# EAGLE design attiny85 (EAGLE 9.6.2)
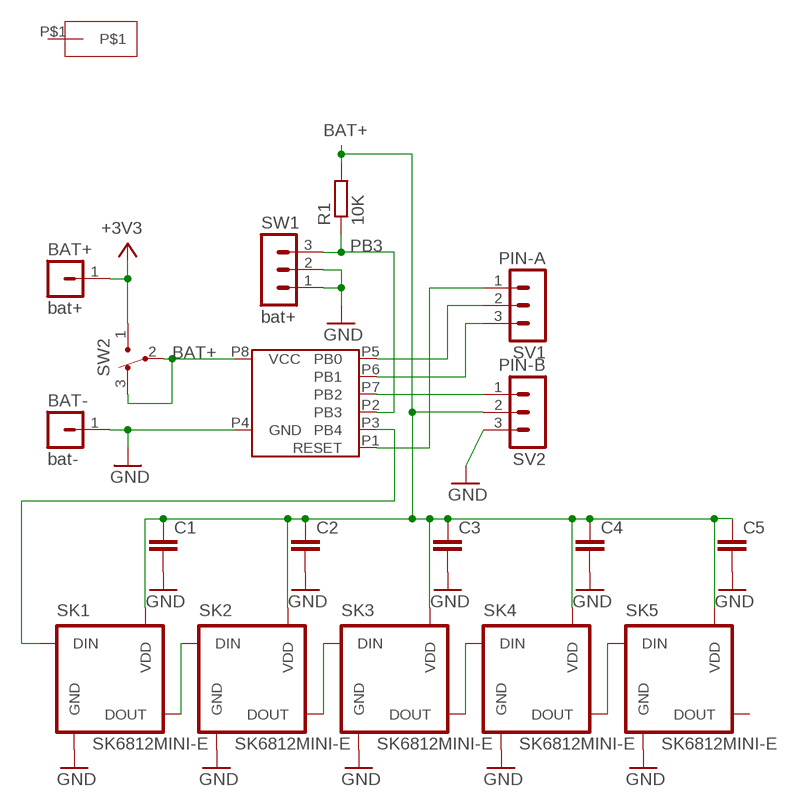
[diagram p0: schematic, sheet 1]

## Parts
ATTINY85-1  ATTINY85  ATTINY85SOP8  [ATTINY85-20SUR]
BAT+  bat+  PINHEAD-MA01-1  [PINHEAD-MA01-1]
BAT-  bat-  PINHEAD-MA01-1  [PINHEAD-MA01-1]
C1  C-EUC2012  [C2012]
C2  C-EUC2012  [C2012]
C3  C-EUC2012  [C2012]
C4  C-EUC2012  [C2012]
C5  C-EUC2012  [C2012]
PAD33  PAD150X50  [PAD5X15]
R1  10K  R-EU_M3216  [M3216]
SK1  SK6812MINI-E  [SK6812MINI-E]
SK2  SK6812MINI-E  [SK6812MINI-E]
SK3  SK6812MINI-E  [SK6812MINI-E]
SK4  SK6812MINI-E  [SK6812MINI-E]
SK5  SK6812MINI-E  [SK6812MINI-E]
SV1  PIN-A  PINHEAD-MA03-1  [PINHEAD-MA03-1]
SV2  PIN-B  PINHEAD-MA03-1  [PINHEAD-MA03-1]
SW1  bat+  PINHEAD-MA03-1  [PINHEAD-MA03-1]
SW2  POWER  SW3-1  [SW3-1]

## Nets
+3V3: BAT+.1 SW2.1
BAT+: ATTINY85-1.P8(VCC) C1.1 C2.1 C3.1 C4.1 C5.1 R1.2 SK1.VDD SK2.VDD SK3.VDD SK4.VDD SK5.VDD SV2.2 SW2.2 SW2.3
GND: ATTINY85-1.P4(GND) BAT-.1 C1.2 C2.2 C3.2 C4.2 C5.2 SK1.GND SK2.GND SK3.GND SK4.GND SK5.GND SV2.3 SW1.1 SW1.2
N$1: ATTINY85-1.P3(PB4) SK1.DIN
N$2: ATTINY85-1.P7(PB2) SV2.1
N$3: ATTINY85-1.P6(PB1) SV1.3
N$4: ATTINY85-1.P1(RESET) SV1.1
N$5: ATTINY85-1.P5(PB0) SV1.2
N$6: SK1.DOUT SK2.DIN
N$7: SK2.DOUT SK3.DIN
N$8: SK3.DOUT SK4.DIN
N$9: SK4.DOUT SK5.DIN
PB3: ATTINY85-1.P2(PB3) R1.1 SW1.3
Unconnected: PAD33.P$1 SK5.DOUT

## Library data of the parts
ATTINY85-1 = ytani1:ATTINY85
BAT+ BAT- = ytani1:PINHEAD-MA01-1
C1-C5 = rcl:C-EU: CAPACITOR, European symbol; SPICEPREFIX: C
PAD33 = ytani1:PAD
R1 = rcl:R-EU_: RESISTOR, European symbol; SPICEPREFIX: R
SK1-SK5 = ytani1:SK6812MINI-E
SV1 SV2 SW1 = ytani1:PINHEAD-MA03-1: PIN HEADER; OC_FARNELL: unknown; OC_NEWARK: unknown
SW2 = ytani1:SW3-1: Slide Switch 3x1 pin https://www.amazon.co.jp/gp/product/B01LYVYQNO/ SS12D00G3 2ポジションSPDT 1P2T 3ピン; MF: HiLetgo; URL_AMAZON: https://www.amazon.co.jp/gp/product/B01LYVYQNO/

## Board
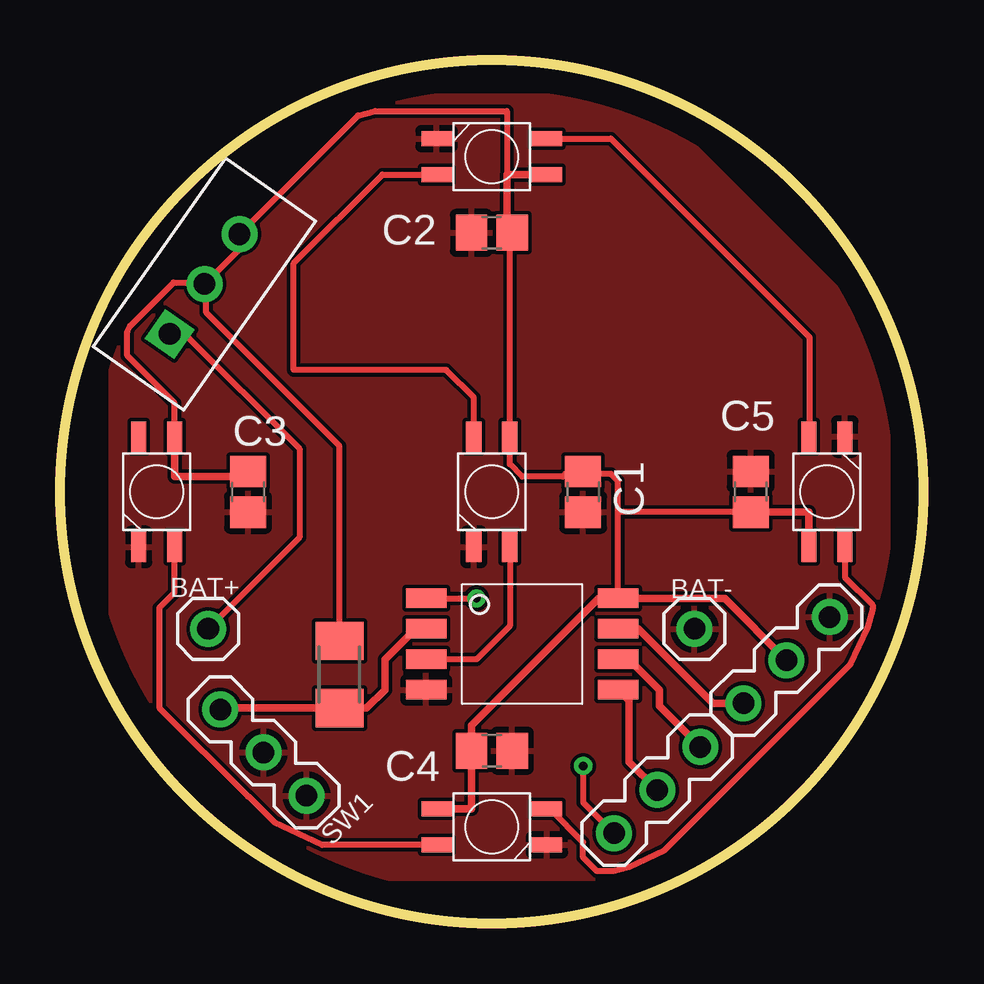
[diagram p1: board, top side]
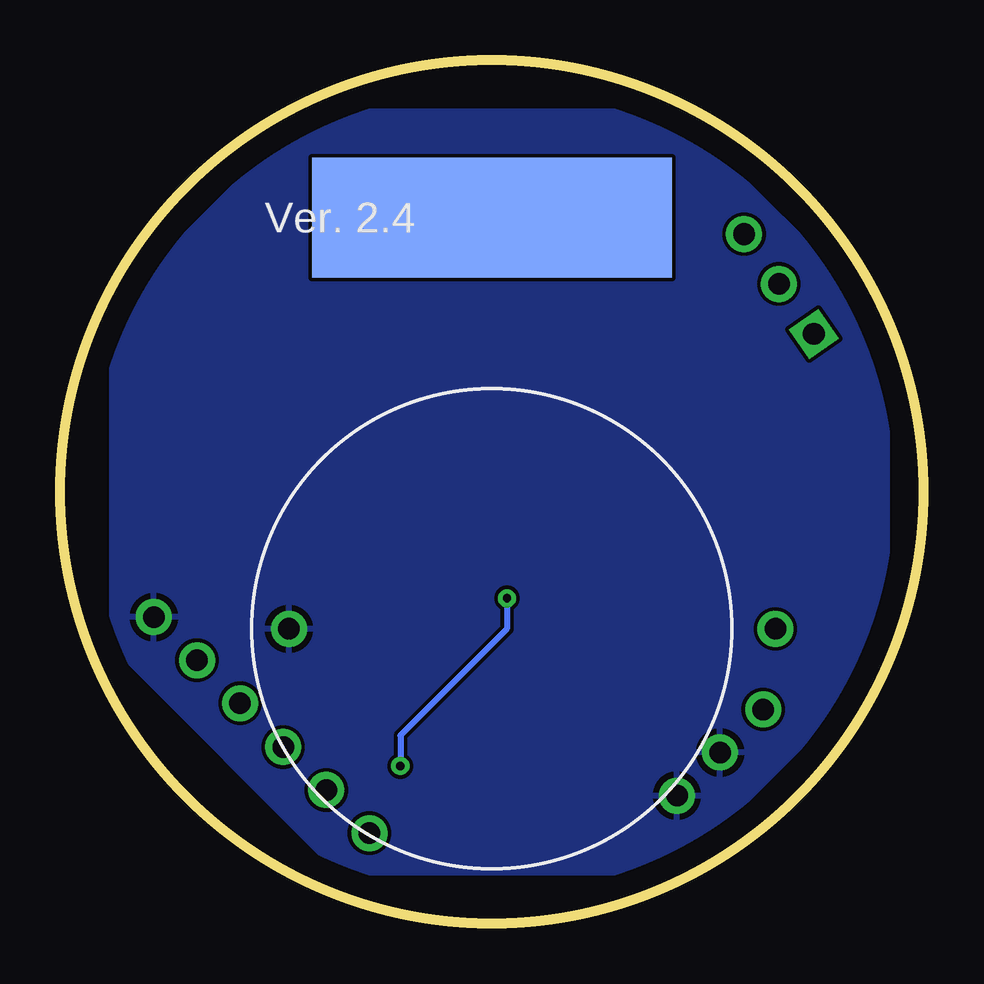
[diagram p2: board, bottom side, seen from below]

Size 36 x 36 mm. Coordinates in mm from the lower left corner, seen from the top.
Outline: circle at 18,18 radius 18
Copper layers (1*16): Top 0.035mm / dielectric 1.5mm / Bottom 0.035mm
Design rules "default": minimum track width 6mil, minimum drill 0.35mm, track to track 6mil, track to pad 6mil, pad to pad 6mil, via to via 6mil, smd to smd 6mil, copper to edge 40mil, drill to drill 6mil, minimum pad ring 10mil, minimum via ring 8mil, stop-mask expansion 4mil, vias tented up to drill 0mil, thermal gap 10mil

### Footprints (pad centres in the part's own frame; a part is rotated, then mirrored left to right if it is on the bottom)
ATTINY85-20SUR = smd 1.676 x 0.813: P1 -4,1.905; P2 -4,0.635; P3 -4,-0.635; P4 -4,-1.905; P5 4,-1.905; P6 4,-0.635; P7 4,0.635; P8 4,1.905
PINHEAD-MA01-1 = drill 0.9 pad 1.5: 1 1.27,0
C2012 = smd 1.3 x 1.5: 1 -0.85,0; 2 0.85,0
PAD5X15 = smd 15 x 5: P$1 0,0
M3216 = smd 1.6 x 2: 1 -1.4,0; 2 1.4,0
SK6812MINI-E = smd 1.27 x 0.635: DIN 2.3,0.75; DOUT -2.3,-0.75; GND 2.3,-0.75; VDD -2.3,0.75
PINHEAD-MA03-1 = drill 0.9 pad 1.5: 1 -1.27,0; 2 1.27,0; 3 3.81,0
SW3-1 = drill 0.9 pad 1.5 square: 1 -1.27,0 | drill 0.9 pad 1.5: 2 1.27,0; 3 3.81,0

### Placement (x,y rotation side)
ATTINY85-1  19.27,11.65 0 top
BAT+  4.91,12.28 0 top
BAT-  25.19,12.28 0 top
C1  21.81,18 270 top
C2  18,28.8 180 top
C3  7.84,18 270 top
C4  18,7.2 0 top
C5  28.8,18 90 top
PAD33  18,29.43 0 bottom
R1  11.65,10.38 90 top
SK1  18,18 270 top
SK2  18,31.97 180 top
SK3  31.97,18 90 top
SK4  18,4.03 0 top
SK5  4.03,18 270 top
SV1  24,4.66 45 top
SV2  29.39,10.08 45 top
SW1  9.38,6.23 135 top
SW2  5.3,25.62 55 top

### Tracks (layer width: path | path; a pad name or v marks a point on that pad's centre or on a via)
+3V3
  Top 0.254: BAT+.1 9.98,16.09 9.98,19.8 5.21,24.58 SW2.1
BAT+
  Top 0.254: 21.7,18.74 C1.1 | SK5.VDD 4.78,21.7 2.8,23.67 2.8,24.67 2.92,24.91 4.73,26.73 5.96,26.73 SW2.2 6.1,26.73 | C2.1 18.75,28.7 SK1.VDD 18.75,19.16 19.27,18.63 20.96,18.63 21.07,18.74 21.7,18.74 | 23.27,17.15 23.27,18.45 22.97,18.74 21.7,18.74 | C5.1 23.27,17.15 | ATTINY85-1.P8 23.27,17.15 | 18.63,30.7 18.63,33.88 13.15,33.88 12.43,33.68 SW2.3 7.48,28.12 6.1,26.73 | R1.2 11.65,19.91 6.1,25.46 6.1,26.73
  Top 0.305: SV2.2 27.71,13.55 ATTINY85-1.P8 22.45,13.55 17.15,8.26 C4.1 17.15,4.78 SK4.VDD | SK5.VDD 4.78,18.63 7.62,18.63 C3.1 | SK2.VDD 18.63,31.22 18.63,30.7 18.63,29.01 C2.1 | SK3.VDD 31.22,17.15 C5.1
GND
  pour Top: 2.12,9.74 2.12,25.62 11.02,34.51 24.35,34.51 34.51,24.35 34.51,11.02 25.37,1.87 10,1.87
  pour Bottom: 1.49,11.02 1.49,24.98 10.38,33.88 25.62,33.88 33.88,25.62 33.88,11.65 24.35,2.12 10.38,2.12
N$1
  Top 0.254: SK1.DIN 18.75,12.4 17.37,11.02 ATTINY85-1.P3
N$2
  Top 0.305: SV2.1 27.22,9.18 24.12,12.28 ATTINY85-1.P7
N$3
  Top 0.305: ATTINY85-1.P6 23.72,11.02 24.98,9.74 24.98,9.07 SV1.3
N$4  (via drill 0.35)
  Top 0.254: ATTINY85-1.P1 v17.37,13.55 | SV1.1 21.81,5.06 v21.81,6.57
  Bottom 0.254: v17.37,13.55 17.37,12.28 21.81,7.84 v21.81,6.57
N$5
  Top 0.305: ATTINY85-1.P5 23.72,9.3 23.72,6.75 SV1.2
N$6
  Top 0.254: SK1.DOUT 17.25,21.92 16.09,23.08 9.75,23.08 9.75,27.52 13.44,31.22 SK2.DIN
N$7
  Top 0.254: SK2.DOUT 22.97,32.72 31.24,24.44 31.24,20.32 SK3.DIN
N$8
  Top 0.254: SK3.DOUT 32.72,14.43 33.88,13.27 33.88,13.15 33.65,12.3 32.95,10.81 25.19,3.05 23.7,2.35 23.06,2.18 22.39,2.18 21.81,2.76 21.81,3.39 20.43,4.78 SK4.DIN
N$9
  Top 0.254: SK4.DOUT 10.95,3.28 8.95,4.21 7.86,5.3 7.84,5.3 4.14,9 4.14,13.16 4.78,13.8 SK5.DIN
PB3
  Top 0.305: SW1.3 6.74,8.98 R1.1 12.79,8.98 13.55,9.74 13.55,11.02 14.83,12.28 ATTINY85-1.P2

### Text on the board
bPlace: Ver. 2.4